# EAGLE design springswitchblink (EAGLE 9.0.0)

## Sheet 1 of 2
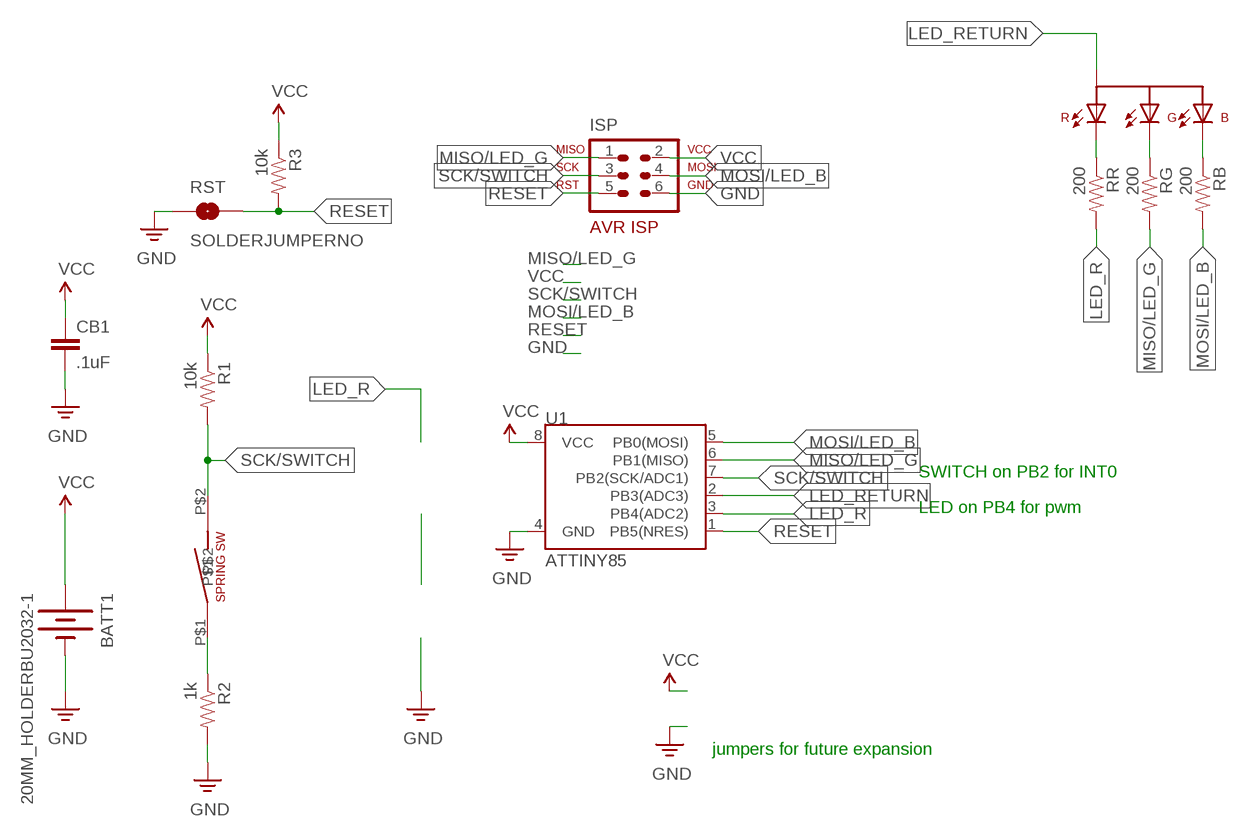
[diagram p0: schematic, sheet 1]

### Parts
BATT1  20MM_HOLDERBU2032-1  [BU2032-1]
CB1  .1uF  CAP0603-CAP  [0603-CAP]
D1  LED-RGBPLCC4  [PLCC4]
ISP  ISP  MYISP-AVR-ISP-6VERT  [NOSS_AVR-ISP-6]
R1  10k  RESISTOR0603-RES  [0603-RES]
R2  1k  RESISTOR0603-RES  [0603-RES]
R3  10k  RESISTOR0603-RES  [0603-RES]
RB  200  RESISTOR0603-RES  [0603-RES]
RG  200  RESISTOR0603-RES  [0603-RES]
RR  200  RESISTOR0603-RES  [0603-RES]
RST  SOLDERJUMPERNO  [SJ_2S-NO]
S1  SPRING_SWITCH  [SW-18020P-RA]
U1  ATTINY85  ATTINY45  [SO08-EIAJ]

### Nets
GND [pwr]: BATT1.- CB1.2 ISP.6 R2.2 RST.1 U1.4(GND)
LED_R: RR.2 U1.3(PB4(ADC2))
LED_RETURN: D1.P$2(A) U1.2(PB3(ADC3))
MISO/LED_G: ISP.1 RG.2 U1.6(PB1(MISO))
MOSI/LED_B: ISP.4 RB.2 U1.5(PB0(MOSI))
N$2: R2.1 S1.P$1
N$3: D1.P$1(R-C) RR.1
N$4: D1.P$4(G-C) RG.1
N$5: D1.P$3(B-C) RB.1
RESET: ISP.5 R3.2 RST.2 U1.1(PB5(NRES))
SCK/SWITCH: ISP.3 R1.2 S1.P$2 U1.7(PB2(SCK/ADC1))
VCC [pwr]: BATT1.+@1(+) BATT1.+@2(+) CB1.1 ISP.2 R1.1 R3.1 U1.8(VCC)

### Notes on the sheet
- SWITCH on PB2 for INT0
- LED on PB4 for pwm
- jumpers for future expansion

## Sheet 2 of 2

## Library data of the parts
BATT1 = battery_holders:20MM_HOLDER
CB1 = SparkFun-Capacitors:CAP: Capacitor Standard 0603 ceramic capacitor, and 0.1" leaded capacitor.
D1 = my library:LED-RGB: LED-Bicolor Red/Green From Pinoccio library
ISP = my library:MYISP-AVR-ISP-6: AVR ISP-6 Serial Programming Header
R1-R3 RB RG RR = SparkFun-Resistors:RESISTOR: Resistor Basic schematic elements and footprints for 0603, 1206, and PTH resistors.
RST = Pinoccio:SOLDERJUMPER: Solder Jumper Standard SMD solder jumper. Used to automate production. Two varients : Normally Open and Normally Closed are the same, but have different paste layers. NC will have a large amount of paste and should jumper during reflow.
S1 = spring_switch:SPRING_SWITCH
U1 = my library:ATTINY45: Atmel 8-pin 2/4/8kB flash uC

## Net classes
1 pwr: width 0.305 mm

## Board
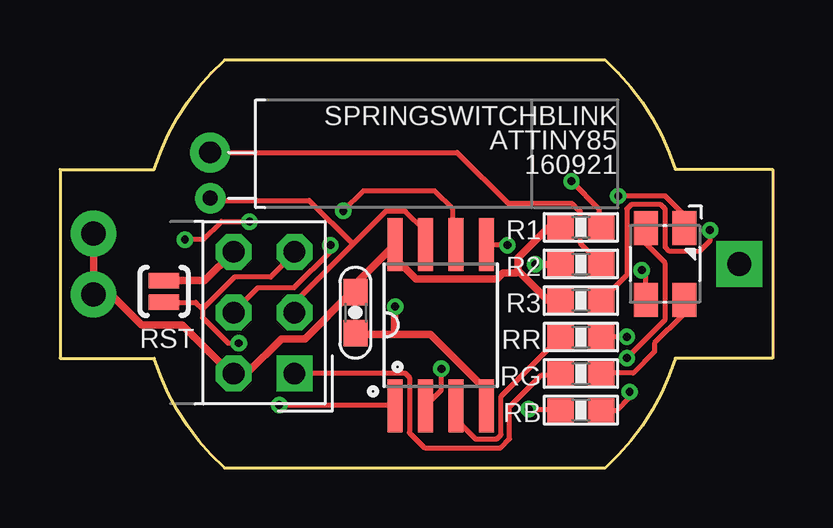
[diagram p1: board, top side]
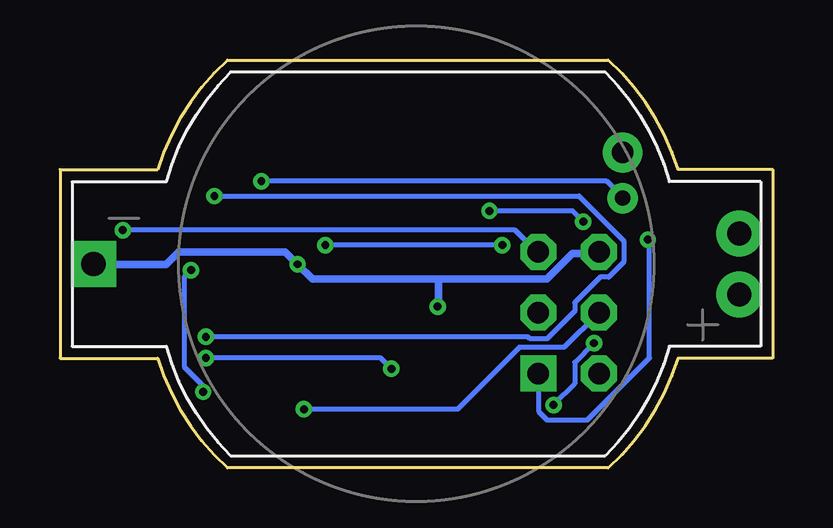
[diagram p2: board, bottom side, seen from below]

Size 29.72 x 17.02 mm. Coordinates in mm from the lower left corner, seen from the top.
Outline: 0,12.45 0,4.57 3.94,4.57 arc30 6.86,0 22.73,0 arc30 25.65,4.57 29.72,4.57 29.72,12.45 25.65,12.45 arc30 22.73,17.02 6.86,17.02 arc30 3.94,12.45 0,12.45
Copper layers (1*16): Top 0.0356mm / dielectric 1.5011mm / Bottom 0.0356mm
Design rules "LaenPCBOrder *": minimum track width 8mil, minimum drill 13mil, track to track 6mil, track to pad 6mil, pad to pad 6mil, via to via 6mil, smd to smd 6mil, copper to edge 15mil, drill to drill 6mil, minimum pad ring 7mil, minimum via ring 7mil, stop-mask expansion 3mil, vias tented up to drill 14mil, thermal gap 10mil

### Footprints (pad centres in the part's own frame; a part is rotated, then mirrored left to right if it is on the bottom)
BU2032-1 = drill 1.016 pad 1.905: +@1 26.924,1.27; +@2 26.924,-1.27 | drill 1.016 pad 1.905 square: - 0,0
0603-CAP = smd 1.1 x 1: 1 -0.85,0; 2 0.85,0
PLCC4 = smd 1.4 x 1: P$1 -1.5,0.75; P$2 -1.5,-0.85; P$3 1.5,-0.85; P$4 1.5,0.75
NOSS_AVR-ISP-6 = drill 0.9 pad 1.5 square: 1 -2.54,-1.27 | drill 0.9 pad 1.5 octagon: 2 -2.54,1.27; 3 0,-1.27; 4 0,1.27; 5 2.54,-1.27; 6 2.54,1.27
0603-RES = smd 1.1 x 1: 1 -0.85,0; 2 0.85,0
SJ_2S-NO = smd 0.635 x 1.27: 1 -0.45,0; 2 0.45,0
SW-18020P-RA = drill 0.9 pad 1.651: P$1 0,0 | drill 0.635 pad 1.27: P$2 0,-1.9
SO08-EIAJ = smd 0.61 x 2.21: 1 -1.905,-3.378; 2 -0.635,-3.378; 3 0.635,-3.378; 4 1.905,-3.378; 5 1.905,3.353; 6 0.635,3.353; 7 -0.635,3.353; 8 -1.905,3.353

### Placement (x,y rotation side)
BATT1  28.32,8.51 0 bottom
CB1  12.32,6.48 270 top
D1  25.27,8.51 270 top
ISP  8.51,6.48 90 top
R1  21.72,10.03 0 top
R2  21.72,8.51 180 top
R3  21.72,6.98 0 top
RB  21.72,2.41 180 top
RG  21.72,3.94 180 top
RR  21.72,5.46 180 top
RST  4.34,7.36 270 top
S1  6.26,13.16 0 top
U1  15.88,5.97 0 top

### Tracks (layer width: path | path; a pad name or v marks a point on that pad's centre or on a via)
GND  (via drill 0.33)
  Top 0.305: 13.95,5.56 15.46,5.56 17.77,3.25 17.77,2.63 U1.4 | 13.95,5.56 12.34,5.56 CB1.2 | 7.19,8.94 ISP.6 6.03,7.81 RST.1 | v19.81,8.5 20.79,8.5 R2.2 | 13.95,5.56 13.95,6.71 v13.97,6.73
  Bottom 0.305: BATT1.- 28.26,8.5 25.29,8.5 24.76,9.02 20.33,9.02 v19.81,8.5 19.19,7.87 13.95,7.87 | 13.95,7.87 9.41,7.87 8.34,8.94 7.28,8.94 ISP.6 | 13.95,7.87 13.95,6.76 v13.97,6.73
LED_R
  Top 0.203: RR.2 20.79,5.38 18.39,2.99 18.39,1.38 18.21,1.21 17.32,1.21 16.52,2.01 16.52,2.54 U1.3
LED_RETURN  (via drill 0.33)
  Top 0.203: v23.63,4.59 25.23,6.19 25.23,8.55 24.26,9.53 24.26,9.84 D1.P$2 | v15.9,4.14 15.9,3.25 U1.2
  Bottom 0.203: v23.63,4.59 16.34,4.59 v15.9,4.14
MISO/LED_G  (via drill 0.33)
  Top 0.203: RG.2 20.79,3.87 20.08,3.87 18.74,2.54 18.74,1.21 18.39,0.85 15.19,0.85 14.57,1.47 14.57,3.79 14.39,3.96 9.86,3.96 ISP.1 | U1.6 16.43,9.38 16.43,9.92 16.38,9.97 16.38,10.79 15.62,11.56 12.65,11.56 v11.81,10.72 | v5.21,9.53 5.97,9.53 6.73,10.29 v7.89,10.29 v7.9,10.27
  Bottom 0.203: ISP.1 9.77,3.87 9.77,2.36 9.41,2.01 7.72,2.01 5.14,4.59 5.14,9.46 v5.21,9.53 | v11.81,10.72 8.34,10.72 v7.9,10.27
MOSI/LED_B  (via drill 0.33)
  Top 0.203: v19.54,2.45 20.79,2.45 RB.2 | v18.66,9.3 17.86,9.3 U1.5 | v11.28,9.3 11.28,9.03 9.77,7.52 8.26,7.52 7.28,6.54 ISP.4
  Bottom 0.203: v19.54,2.45 13.14,2.45 10.57,5.03 8.7,5.03 7.28,6.45 ISP.4 | v11.28,9.3 v18.66,9.3
N$2
  Top 0.203: R2.1 22.48,8.59 21.68,9.38 21.68,10.72 21.67,10.72 21.34,11.05 18.67,11.05 16.56,13.16 S1.P$1
N$3  (via drill 0.33)
  Top 0.203: v23.63,5.47 22.57,5.47 RR.1 | v23.28,11.34 25.23,11.34 25.95,10.63 25.95,10.1 D1.P$1
  Bottom 0.203: v23.63,5.47 10.21,5.47 10.12,5.38 9.41,5.38 8.26,6.54 8.26,6.9 7.19,7.96 6.83,7.96 6.21,8.59 6.21,9.47 8.08,11.34 v23.28,11.34
N$4
  Top 0.203: 22.57,3.96 RG.1 22.66,3.96 23.9,3.96 24.79,4.85 24.79,5.21 25.95,6.36 25.95,6.9 D1.P$4 25.95,6.98
N$5  (via drill 0.33)
  Top 0.203: RB.1 23.24,2.41 23.75,2.92 v23.75,3.17 | D1.P$3 24.42,8.09 v24.26,8.26
  Bottom 0.203: v23.75,3.17 23.75,3.43 24.51,4.19 24.51,8 v24.26,8.26
RESET  (via drill 0.33)
  Top 0.203: v27.1,9.92 27.1,9.47 26.66,9.03 25.41,9.03 25.23,9.21 25.23,10.81 25.06,10.98 23.81,10.98 23.63,10.81 23.63,8.05 R3.2 | 5.94,6.63 7.28,7.96 8.79,7.96 9.77,8.94 ISP.5 | v9.14,2.63 13.95,2.63 U1.1 | v7.46,5.21 7.01,5.21 5.94,6.27 5.94,6.63 | RST.2 5.66,6.91 5.94,6.63
  Bottom 0.203: v27.1,9.92 10.74,9.92 9.86,9.03 ISP.5 | v9.14,2.63 8.26,3.52 8.26,4.41 v7.46,5.21
SCK/SWITCH  (via drill 0.33)
  Top 0.203: 12.21,9.34 9.86,6.98 9.86,6.54 ISP.3 | 12.21,9.34 13.59,10.72 14.39,10.72 15.19,9.92 15.19,9.38 U1.7 | R1.2 22.48,10.1 22.48,10.81 v21.32,11.96 | 6.21,11.34 S1.P$2 6.3,11.16 10.39,11.16 12.21,9.34
  Bottom 0.203: v21.32,11.96 6.92,11.96 6.3,11.34 S1.P$2
VCC
  Top 0.305: BATT1.+@1 1.41,9.74 1.41,7.25 BATT1.+@2 1.5,7.16 2.21,7.16 3.4,5.97 5.09,5.97 7.1,3.96 ISP.2 7.28,3.96 7.81,3.96 9.23,5.38 10.21,5.38 12.17,7.34 CB1.1 12.34,7.34 12.34,7.7 U1.8 13.77,8.94 14.83,7.87 18.21,7.87 18.48,8.14 19.01,8.14 19.1,8.23 | R3.1 20.34,6.98 19.1,8.23 | 19.1,8.23 19.1,8.76 20.34,10.01 20.79,10.01 R1.1

### Text on the board
tPlace: SPRINGSWITCHBLINK | 160921